# EAGLE design ADC_Board_Right (EAGLE 6.1)
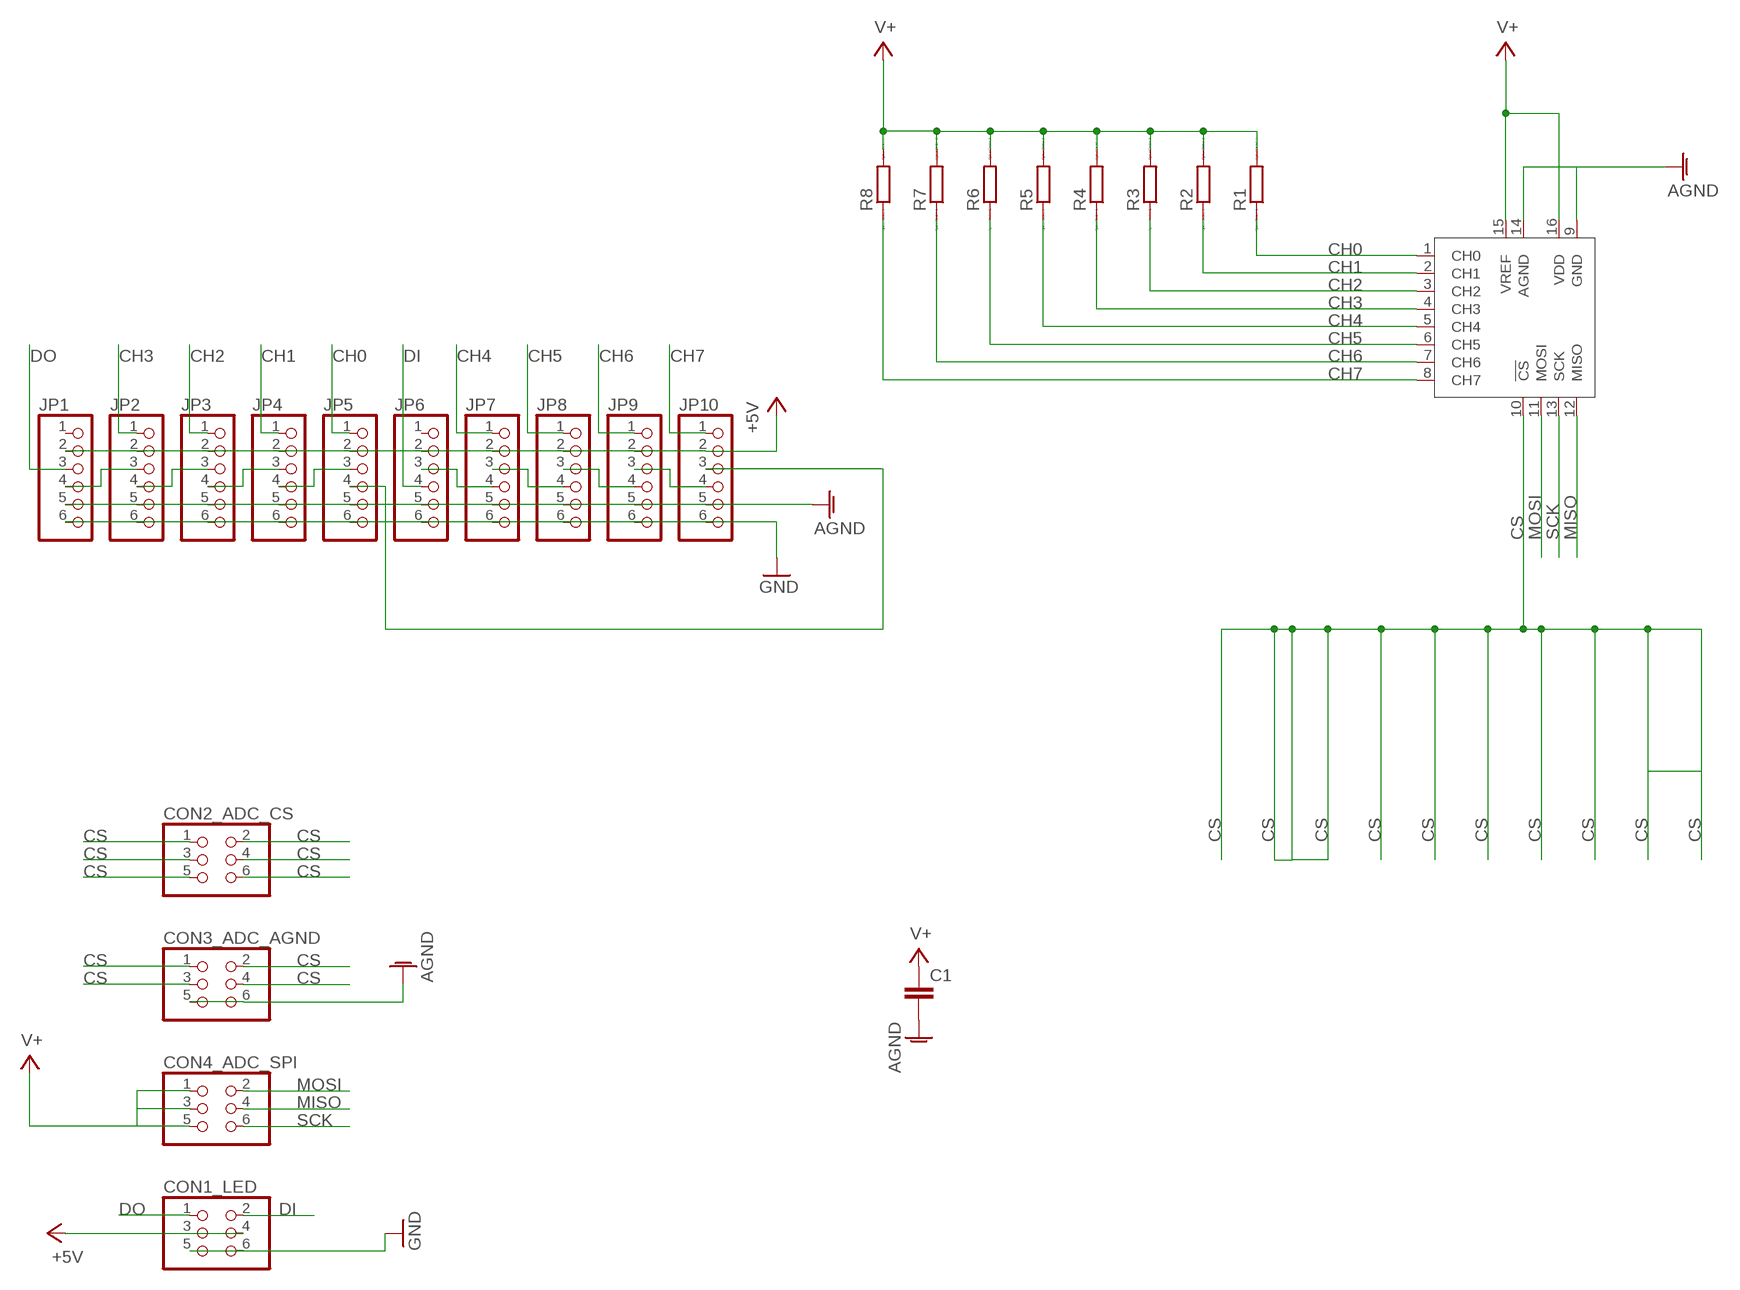
[diagram p0: schematic, sheet 1]

## Parts
C1  C-EU050-025X075  [C050-025X075]
CON1_LED  PINHD-2X3  [2X03]
CON2_ADC_CS  PINHD-2X3  [2X03]
CON3_ADC_AGND  PINHD-2X3  [2X03]
CON4_ADC_SPI  PINHD-2X3  [2X03]
JP1  PINHD-1X6  [1X06]
JP2  PINHD-1X6  [1X06]
JP3  PINHD-1X6  [1X06]
JP4  PINHD-1X6  [1X06]
JP5  PINHD-1X6  [1X06]
JP6  PINHD-1X6  [1X06]
JP7  PINHD-1X6  [1X06]
JP8  PINHD-1X6  [1X06]
JP9  PINHD-1X6  [1X06]
JP10  PINHD-1X6  [1X06]
R1  R-EU_0617_22  [0617/22]
R2  R-EU_0617_22  [0617/22]
R3  R-EU_0617_22  [0617/22]
R4  R-EU_0617_22  [0617/22]
R5  R-EU_0617_22  [0617/22]
R6  R-EU_0617_22  [0617/22]
R7  R-EU_0617_22  [0617/22]
R8  R-EU_0617_22  [0617/22]
U$1  MCP3008P  [DIL16]

## Nets
+5V: CON1_LED.3 CON1_LED.4 JP1.2 JP2.2 JP3.2 JP4.2 JP5.2 JP6.2 JP7.2 JP8.2 JP9.2 JP10.2
AGND: C1.2 CON3_ADC_AGND.5 CON3_ADC_AGND.6 JP1.5 JP2.5 JP3.5 JP4.5 JP5.5 JP6.5 JP7.5 JP8.5 JP9.5 JP10.5 U$1.9(GND) U$1.14(AGND)
CH0: JP5.1 R1.1 U$1.1(CH0)
CH1: JP4.1 R2.1 U$1.2(CH1)
CH2: JP3.1 R3.1 U$1.3(CH2)
CH3: JP2.1 R4.1 U$1.4(CH3)
CH4: JP7.1 R5.1 U$1.5(CH4)
CH5: JP8.1 R6.1 U$1.6(CH5)
CH6: JP9.1 R7.1 U$1.7(CH6)
CH7: JP10.1 R8.1 U$1.8(CH7)
CS: CON2_ADC_CS.1 CON2_ADC_CS.2 CON2_ADC_CS.3 CON2_ADC_CS.4 CON2_ADC_CS.5 CON2_ADC_CS.6 CON3_ADC_AGND.1 CON3_ADC_AGND.2 CON3_ADC_AGND.3 CON3_ADC_AGND.4 U$1.10(!CS)
DI: CON1_LED.2 JP6.4
DO: CON1_LED.1 JP1.3
GND: CON1_LED.5 CON1_LED.6 JP1.6 JP2.6 JP3.6 JP4.6 JP5.6 JP6.6 JP7.6 JP8.6 JP9.6 JP10.6
MISO: CON4_ADC_SPI.4 U$1.12(MISO)
MOSI: CON4_ADC_SPI.2 U$1.11(MOSI)
N$1: JP6.3 JP7.4
N$6: JP1.4 JP2.3
N$7: JP2.4 JP3.3
N$16: JP3.4 JP4.3
N$17: JP4.4 JP5.3
N$18: JP5.4 JP10.3
N$19: JP7.3 JP8.4
N$20: JP8.3 JP9.4
N$21: JP9.3 JP10.4
SCK: CON4_ADC_SPI.6 U$1.13(SCK)
V+: C1.1 CON4_ADC_SPI.1 CON4_ADC_SPI.3 CON4_ADC_SPI.5 R1.2 R2.2 R3.2 R4.2 R5.2 R6.2 R7.2 R8.2 U$1.15(VREF) U$1.16(VDD)
Unconnected: JP1.1 JP6.1

## Library data of the parts
C1 = rcl:C-EU: CAPACITOR, European symbol
CON1_LED CON2_ADC_CS CON3_ADC_AGND CON4_ADC_SPI = pinhead:PINHD-2X3: PIN HEADER
JP1-JP10 = pinhead:PINHD-1X6: PIN HEADER
R1-R8 = resistor:R-EU_: RESISTOR, European symbol; SPICEPREFIX: R
U$1 = MCP3008:MCP3008

## Board
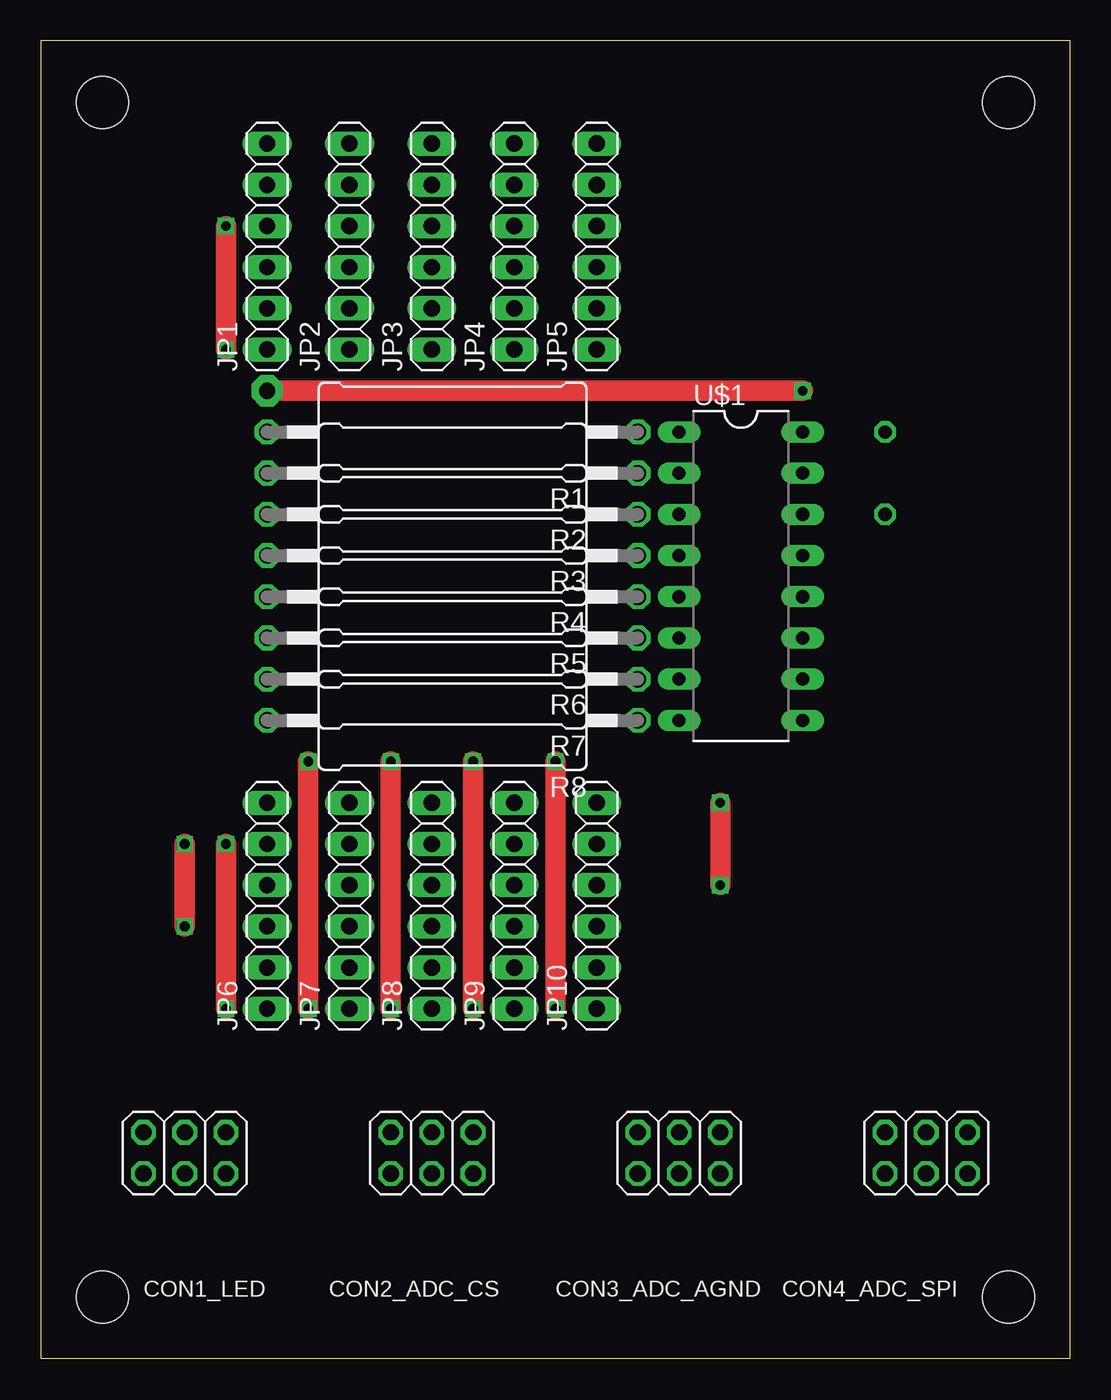
[diagram p1: board, top side]
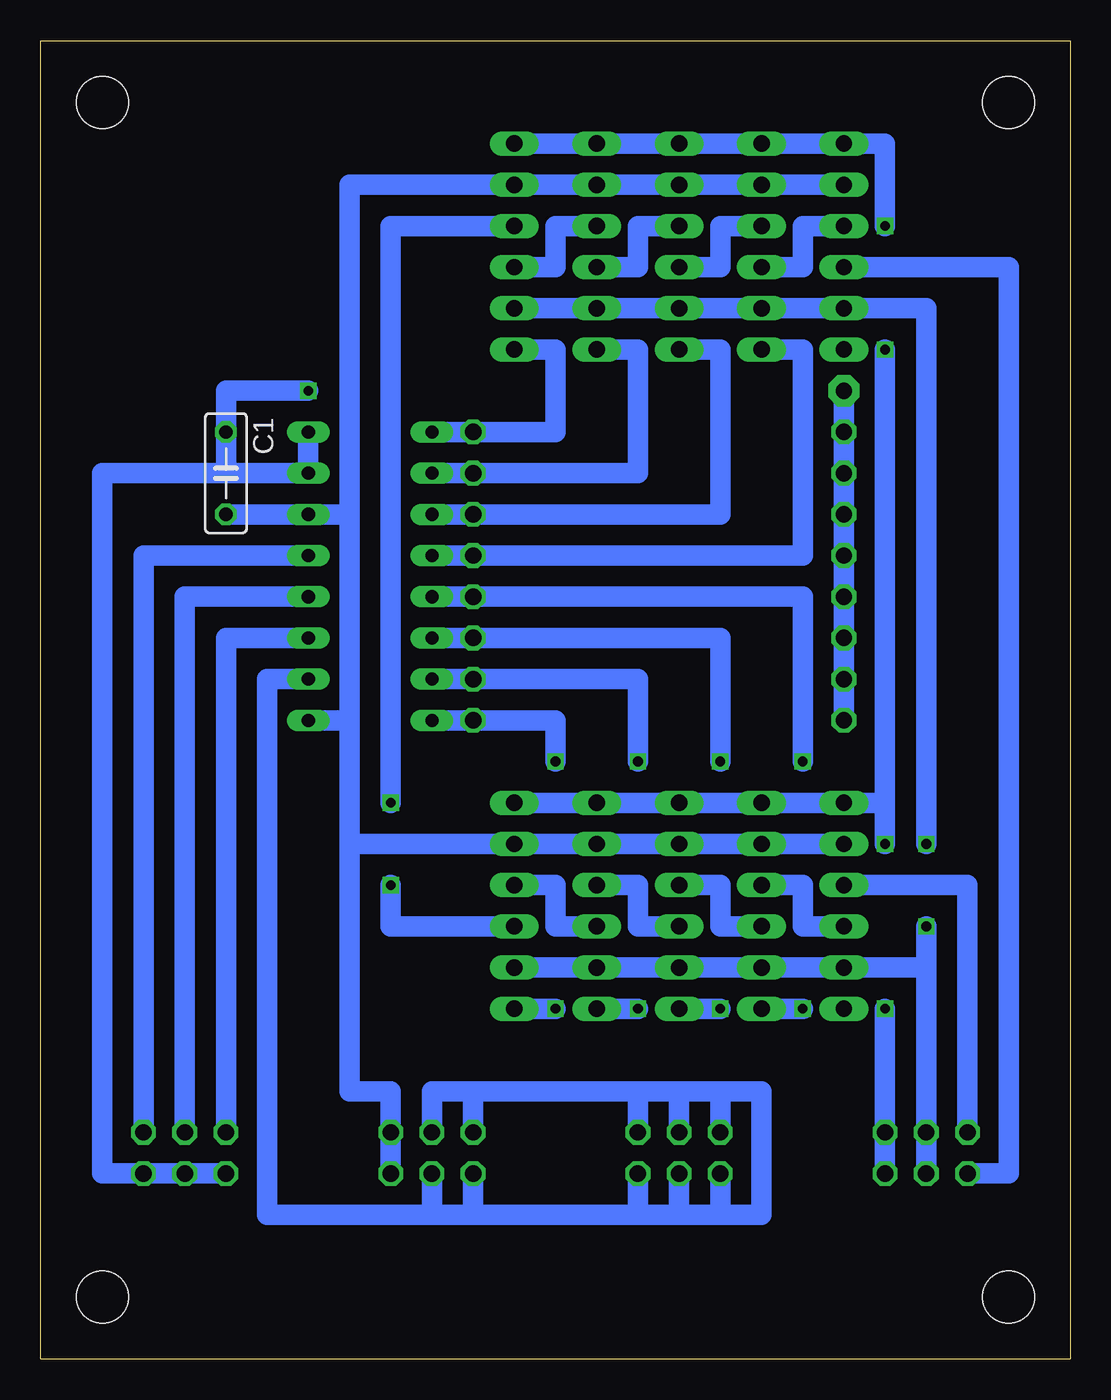
[diagram p2: board, bottom side, seen from below]

Size 63.5 x 81.28 mm. Coordinates in mm from the lower left corner, seen from the top.
Outline: 63.5,0 63.5,81.28 0,81.28 0,0 63.5,0
Copper layers (1*16): Top 0.035mm / dielectric 1.5mm / Bottom 0.035mm
Design rules: minimum track width 10mil, minimum drill 24mil, track to track 15mil, track to pad 15mil, pad to pad 15mil, via to via 15mil, smd to smd 15mil, copper to edge 40mil, drill to drill 8mil, minimum pad ring 10mil, minimum via ring 8mil, stop-mask expansion 4mil, vias tented up to drill 0mil, thermal gap 10mil
Holes 3.2 mm at 3.81,77.47 59.69,77.47 59.69,3.81 3.81,3.81

### Footprints (pad centres in the part's own frame; a part is rotated, then mirrored left to right if it is on the bottom)
C050-025X075 = drill 0.813 octagon: 1 -2.54,0; 2 2.54,0
2X03 = drill 1.016 octagon: 1 -2.54,-1.27; 2 -2.54,1.27; 3 0,-1.27; 4 0,1.27; 5 2.54,-1.27; 6 2.54,1.27
1X06 = drill 1.016 long: 1 -6.35,0; 2 -3.81,0; 3 -1.27,0; 4 1.27,0; 5 3.81,0; 6 6.35,0
0617/22 = drill 1.016 octagon: 1 -11.43,0; 2 11.43,0
DIL16 = drill 0.813 long: 1 -8.89,-3.81; 2 -6.35,-3.81; 3 -3.81,-3.81; 4 -1.27,-3.81; 5 1.27,-3.81; 6 3.81,-3.81; 7 6.35,-3.81; 8 8.89,-3.81; 9 8.89,3.81; 10 6.35,3.81; 11 3.81,3.81; 12 1.27,3.81; 13 -1.27,3.81; 14 -3.81,3.81; 15 -6.35,3.81; 16 -8.89,3.81

### Placement (x,y rotation side)
C1  52.07,54.61 270 bottom
CON1_LED  8.89,12.7 0 top
CON2_ADC_CS  24.13,12.7 0 top
CON3_ADC_AGND  39.37,12.7 0 top
CON4_ADC_SPI  54.61,12.7 0 top
JP1  13.97,68.58 90 top
JP2  19.05,68.58 90 top
JP3  24.13,68.58 90 top
JP4  29.21,68.58 90 top
JP5  34.29,68.58 90 top
JP6  13.97,27.94 90 top
JP7  19.05,27.94 90 top
JP8  24.13,27.94 90 top
JP9  29.21,27.94 90 top
JP10  34.29,27.94 90 top
R1  25.4,57.15 180 top
R2  25.4,54.61 180 top
R3  25.4,52.07 180 top
R4  25.4,49.53 180 top
R5  25.4,46.99 180 top
R6  25.4,44.45 180 top
R7  25.4,41.91 180 top
R8  25.4,39.37 180 top
U$1  43.18,48.26 270 top

### Tracks (layer width: path | path; a pad name or v marks a point on that pad's centre or on a via)
+5V  (via drill 0.6)
  Top 1.27: v8.89,26.67 v8.89,31.75
  Bottom 1.27: CON1_LED.4 CON1_LED.3 v8.89,26.67 8.89,24.13 JP6.2 JP7.2 JP8.2 JP9.2 JP10.2 | v8.89,31.75 8.89,64.77 JP1.2 JP2.2 JP3.2 JP4.2 JP5.2
AGND
  Bottom 1.27: 44.45,52.07 U$1.14 C1.2 | 44.45,31.75 44.45,39.37 | 44.45,39.37 U$1.9 | 44.45,31.75 44.45,16.51 41.91,16.51 CON3_ADC_AGND.6 CON3_ADC_AGND.5 | 44.45,52.07 44.45,39.37 | 44.45,52.07 44.45,72.39 JP5.5 JP4.5 JP3.5 JP2.5 JP1.5 | JP6.5 JP7.5 JP8.5 JP9.5 JP10.5 44.45,31.75
CH0
  Bottom 1.27: U$1.1 R1.1 31.75,57.15 31.75,62.23 JP5.1
CH1
  Bottom 1.27: U$1.2 R2.1 26.67,54.61 26.67,62.23 JP4.1
CH2
  Bottom 1.27: U$1.3 R3.1 21.59,52.07 21.59,62.23 JP3.1
CH3
  Bottom 1.27: U$1.4 R4.1 16.51,49.53 16.51,62.23 JP2.1
CH4  (via drill 0.6)
  Top 1.27: v16.51,36.83 v16.51,21.59
  Bottom 1.27: U$1.5 R5.1 16.51,46.99 v16.51,36.83 | v16.51,21.59 JP7.1
CH5  (via drill 0.6)
  Top 1.27: v21.59,36.83 v21.59,21.59
  Bottom 1.27: U$1.6 R6.1 21.59,44.45 v21.59,36.83 | v21.59,21.59 JP8.1
CH6  (via drill 0.6)
  Top 1.27: v26.67,21.59 v26.67,36.83
  Bottom 1.27: U$1.7 R7.1 26.67,41.91 26.67,40.64 v26.67,36.83 | JP9.1 v26.67,21.59
CH7  (via drill 0.6)
  Top 1.27: v31.75,21.59 v31.75,36.83
  Bottom 1.27: U$1.8 R8.1 31.75,39.37 v31.75,36.83 | JP10.1 v31.75,21.59
CS
  Bottom 1.27: U$1.10 49.53,41.91 49.53,8.89 39.37,8.89 | 39.37,8.89 36.83,8.89 | 24.13,8.89 19.05,8.89 19.05,16.51 24.13,16.51 | 24.13,8.89 26.67,8.89 CON2_ADC_CS.5 | 24.13,8.89 21.59,8.89 CON2_ADC_CS.1 | CON2_ADC_CS.2 21.59,16.51 24.13,16.51 | 24.13,16.51 CON2_ADC_CS.4 | CON2_ADC_CS.3 24.13,8.89 | CON2_ADC_CS.6 26.67,16.51 24.13,16.51 | CON3_ADC_AGND.2 36.83,16.51 | 36.83,16.51 24.13,16.51 | CON3_ADC_AGND.4 39.37,16.51 36.83,16.51 | CON3_ADC_AGND.3 39.37,8.89 | 24.13,8.89 36.83,8.89 | 36.83,8.89 CON3_ADC_AGND.1
DI
  Bottom 1.27: CON1_LED.2 6.35,29.21 JP6.4
DO
  Bottom 1.27: CON1_LED.1 3.81,11.43 3.81,67.31 JP1.3
GND  (via drill 0.6)
  Top 1.27: v11.43,21.59 v11.43,31.75 | v11.43,69.85 v11.43,62.23
  Bottom 1.27: CON1_LED.5 CON1_LED.6 v11.43,21.59 | JP10.6 JP9.6 JP8.6 JP7.6 JP6.6 11.43,34.29 v11.43,31.75 v11.43,62.23 | JP3.6 JP2.6 JP1.6 11.43,74.93 v11.43,69.85 | 25.4,74.93 JP3.6 | JP3.6 JP4.6 JP5.6
MISO
  Bottom 1.27: U$1.12 54.61,46.99 CON4_ADC_SPI.4
MOSI
  Bottom 1.27: U$1.11 52.07,44.45 CON4_ADC_SPI.2
N$1
  Bottom 1.27: JP7.4 16.51,29.21 16.51,26.67 JP6.3
N$6
  Bottom 1.27: JP2.3 16.51,67.31 16.51,69.85 JP1.4
N$7
  Bottom 1.27: JP3.3 21.59,67.31 21.59,69.85 JP2.4
N$16
  Bottom 1.27: JP4.3 26.67,67.31 26.67,69.85 JP3.4
N$17
  Bottom 1.27: JP5.3 31.75,67.31 31.75,69.85 JP4.4
N$18  (via drill 0.6)
  Top 1.27: v41.91,29.21 v41.91,34.29
  Bottom 1.27: v41.91,34.29 41.91,69.85 JP5.4 | v41.91,29.21 41.91,26.67 JP10.3
N$19
  Bottom 1.27: JP8.4 21.59,29.21 21.59,26.67 JP7.3
N$20
  Bottom 1.27: JP9.4 26.67,29.21 26.67,26.67 JP8.3
N$21
  Bottom 1.27: JP10.4 31.75,29.21 31.75,26.67 JP9.3
SCK
  Bottom 1.27: U$1.13 57.15,49.53 CON4_ADC_SPI.6
V+  (via drill 0.6, 1 pad 1.93)
  Top 1.27: v13.97,59.69 v46.99,59.69
  Bottom 1.27: U$1.16 U$1.15 52.07,54.61 | 52.07,54.61 59.69,54.61 59.69,11.43 CON4_ADC_SPI.5 CON4_ADC_SPI.3 CON4_ADC_SPI.1 | v46.99,59.69 52.07,59.69 C1.1 52.07,54.61 | R7.2 R8.2 v13.97,59.69 R1.2 R2.2 R3.2 R4.2 R5.2 R6.2 R7.2

### Text on the board
tDocu: LEFT CABLES | RIGHT BOARD | CS 1 | CS 3 | CS 5 | CS 7 | CS 9 | MOSI | MISO | SCK | DI | 5V | GND | AGND | D0 | 5V | GND | AGND | V+ | V+ | V+ | CS 0 | CS 2 | CS 4 | CS 6 | CS 8